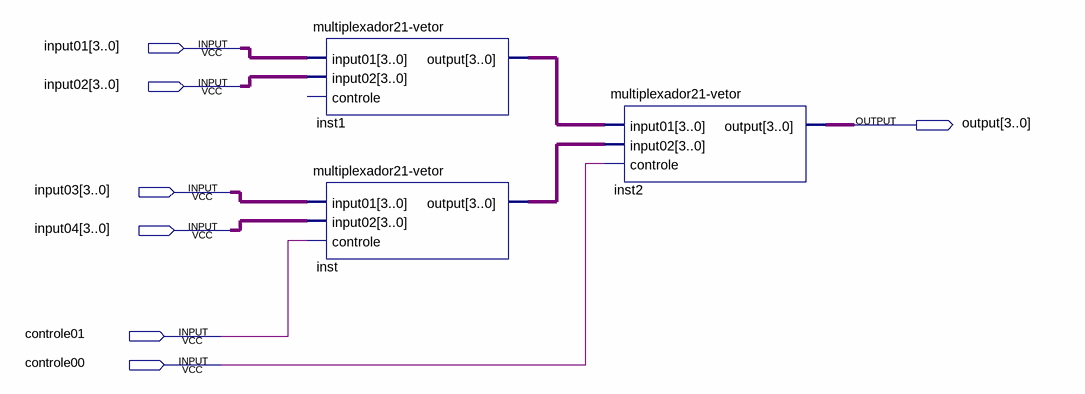
[diagram p0: schematic sheet]
// Quartus schematic multiplexador41-vetor.bdf as structural Verilog: 3 symbols, 7 pins
module \multiplexador41-vetor  (
  input  [3:0] input01,
  input  [3:0] input02,
  input  [3:0] input03,
  input  [3:0] input04,
  input  controle01,
  input  controle00,
  output [3:0] \output 
);

  wire [3:0] inst1_output, inst_output;

  \multiplexador21-vetor  inst1 (.input01(input01), .input02(input02), .\output (inst1_output));  // open: controle
  \multiplexador21-vetor  inst (.input01(input03), .input02(input04), .controle(controle01), .\output (inst_output));
  \multiplexador21-vetor  inst2 (
    .input01(inst1_output), .input02(inst_output), .controle(controle00), .\output (\output ));
endmodule
